# EAGLE design 07D-003 (EAGLE 6.3)
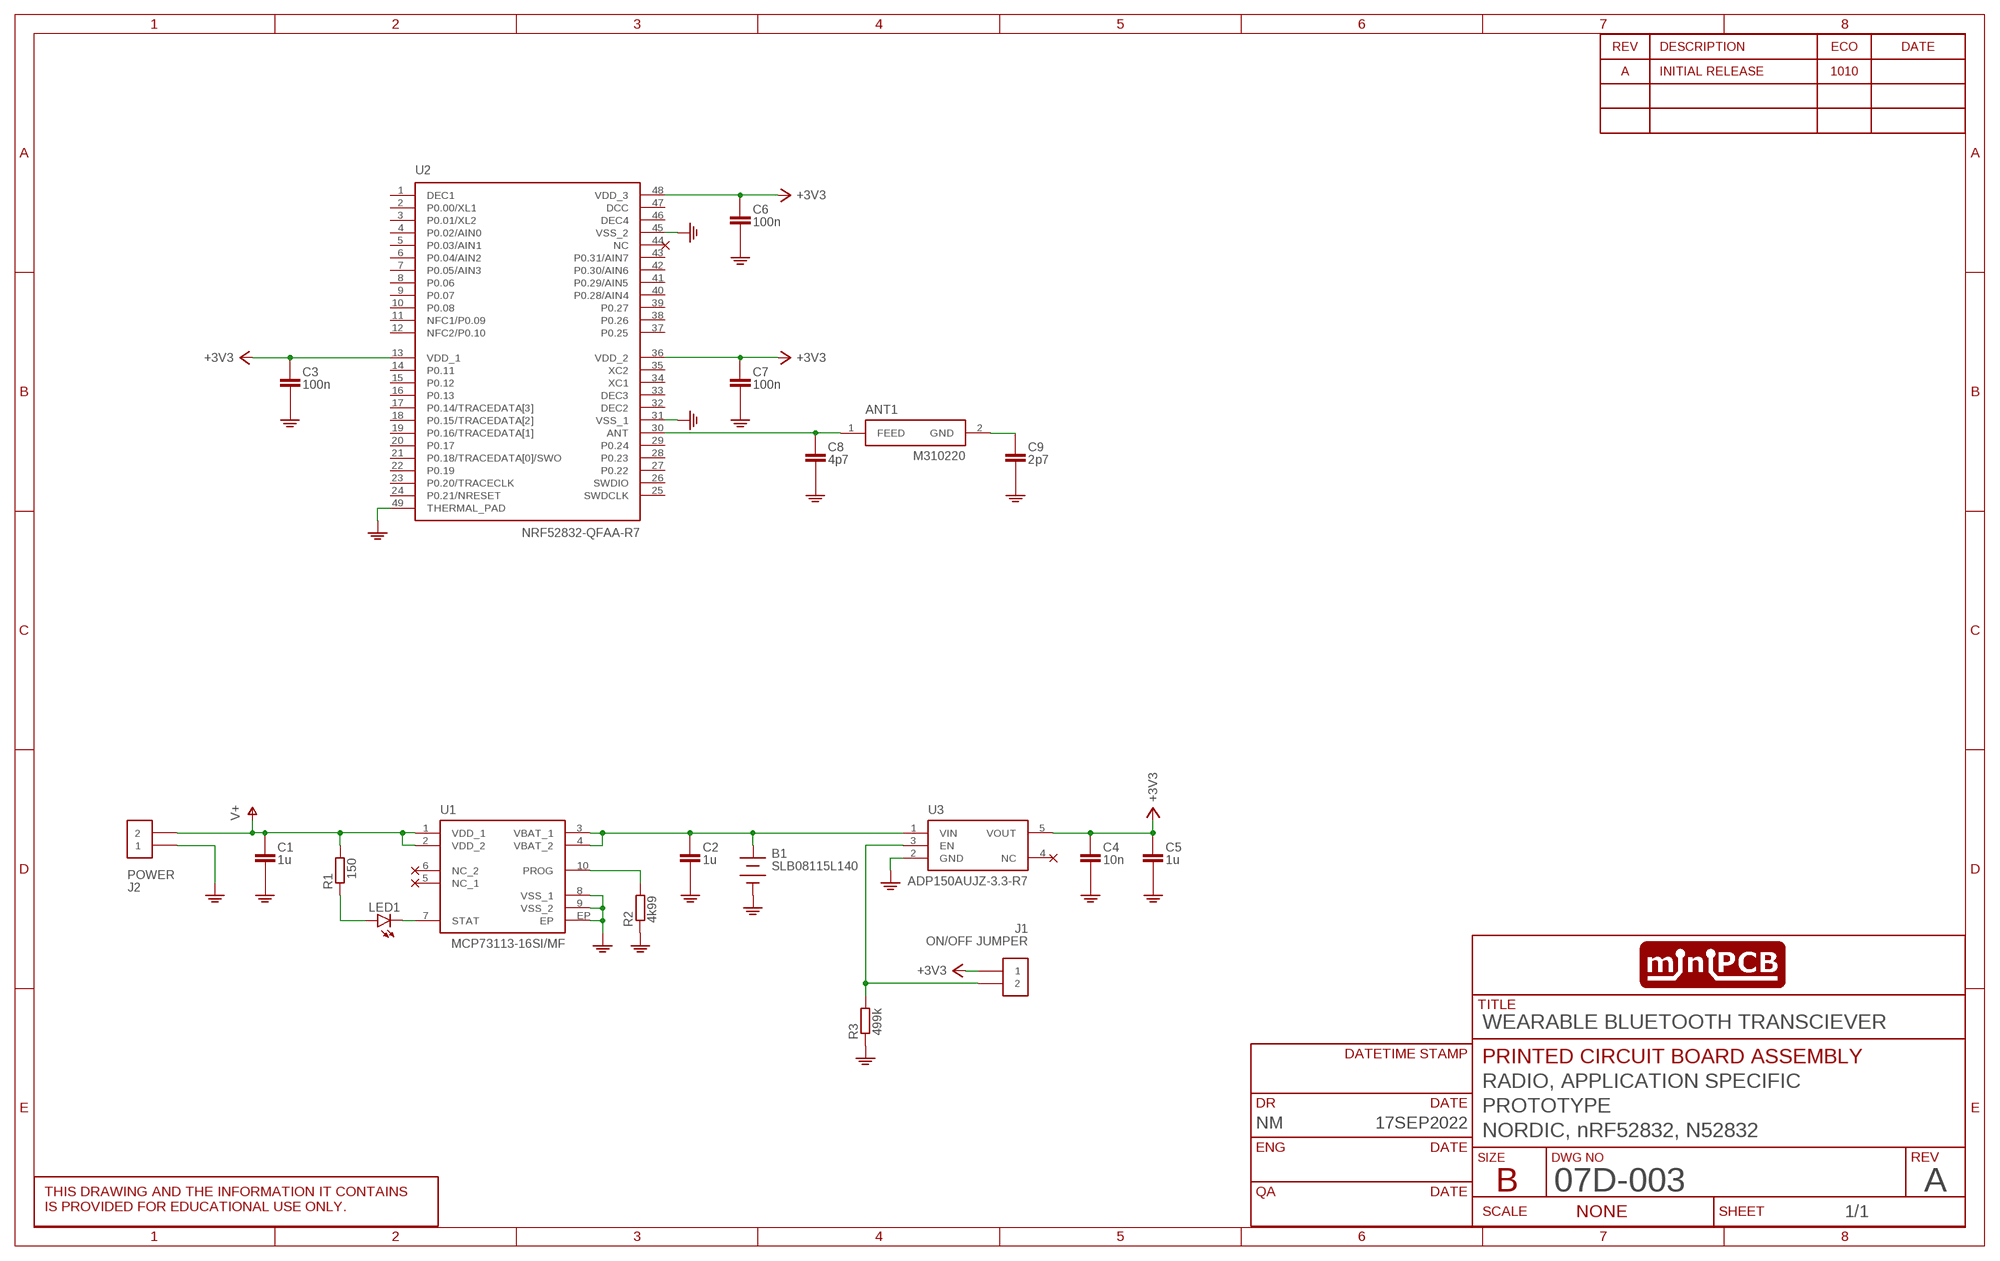
[diagram p0: schematic, sheet 1]
SHEET1 (SCHEMATIC): CIRCUIT_CATEGORY: RADIO, APPLICATION SPECIFIC; CIRCUIT_NAME: PROTOTYPE; CIRCUIT_VARIANT: NORDIC, nRF52832, N52832; DR: NM; DR_DATE: 17SEP2022; PCB_PCBA: PRINTED CIRCUIT BOARD ASSEMBLY; REVA: A; REVA_ECO: 1010; REVISION: A; TITLE: WEARABLE BLUETOOTH TRANSCIEVER

## Parts
ANT1  M310220  [M310220]
B1  SLB08115L140  BATTERYSLB08115L140  [BATTERY_SLB08115L140]
C1  1u  CAPACITOR0402  [C0402]
C2  1u  CAPACITOR0402  [C0402]
C3  100n  CAPACITOR0402  [C0402]
C4  10n  CAPACITOR0402  [C0402]
C5  1u  CAPACITOR0402  [C0402]
C6  100n  CAPACITOR0402  [C0402]
C7  100n  CAPACITOR0402  [C0402]
C8  4p7  CAPACITOR0402  [C0402]
C9  2p7  CAPACITOR0402  [C0402]
J1  ON/OFF JUMPER  PINS_2  [PINS_2]
J2  POWER  PINS_2  [PINS_2]
LED1  LEDSML0603  [SML0603]
R1  150  RESISTOR0402  [R0402]
R2  4k99  RESISTOR0402  [R0402]
R3  499k  RESISTOR0402  [R0402]
U1  MCP73113-16SI/MF  MCP73113-16SI_MF  [DFN-10]
U2  NRF52832-QFAA-R7  [QFN40P600X600X90-49N]
U3  ADP150AUJZ-3.3-R7  ADP150  [SOT25]

## Nets
+3V3: C3.1(+) C4.1(+) C5.1(+) C6.1(+) C7.1(+) J1.1 U2.13(VDD_1) U2.36(VDD_2) U2.48(VDD_3) U3.5(VOUT)
ANTFEED: ANT1.1(FEED) C8.1(+) U2.30(ANT)
ANTGND: ANT1.2(GND) C9.1(+)
B+: B1.1+(+) C2.1(+) U1.3(VBAT_1) U1.4(VBAT_2) U3.1(VIN)
ENABLE: J1.2 R3.2 U3.3(EN)
GND: B1.2-(-) C1.2(-) C2.2(-) C3.2(-) C4.2(-) C5.2(-) C6.2(-) C7.2(-) C8.2(-) C9.2(-) J2.1 R2.1 R3.1 U1.8(VSS_1) U1.9(VSS_2) U1.EP U2.31(VSS_1) U2.45(VSS_2) U2.49(THERMAL_PAD) U3.2(GND)
LED+: LED1.A R1.1
PROG: R2.2 U1.10(PROG)
STAT: LED1.C U1.7(STAT)
V+: C1.1(+) J2.2 R1.2 U1.1(VDD_1) U1.2(VDD_2)
Unconnected: U1.5(NC_1) U1.6(NC_2) U2.1(DEC1) U2.2(P0.00/XL1) U2.3(P0.01/XL2) U2.4(P0.02/AIN0) U2.5(P0.03/AIN1) U2.6(P0.04/AIN2) U2.7(P0.05/AIN3) U2.8(P0.06) U2.9(P0.07) U2.10(P0.08) U2.11(NFC1/P0.09) U2.12(NFC2/P0.10) U2.14(P0.11) U2.15(P0.12) U2.16(P0.13) U2.17(P0.14/TRACEDATA[3]) U2.18(P0.15/TRACEDATA[2]) U2.19(P0.16/TRACEDATA[1]) U2.20(P0.17) U2.21(P0.18/TRACEDATA[0]/SWO) U2.22(P0.19) U2.23(P0.20/TRACECLK) U2.24(P0.21/NRESET) U2.25(SWDCLK) U2.26(SWDIO) U2.27(P0.22) U2.28(P0.23) U2.29(P0.24) U2.32(DEC2) U2.33(DEC3) U2.34(XC1) U2.35(XC2) U2.37(P0.25) U2.38(P0.26) U2.39(P0.27) U2.40(P0.28/AIN4) U2.41(P0.29/AIN5) U2.42(P0.30/AIN6) U2.43(P0.31/AIN7) U2.44(NC) U2.46(DEC4) U2.47(DCC) U3.4(NC)

## Library data of the parts
ANT1 = minipcb:M310220: Antennas Ceramic Chip ANTENNA BT/WLAN 2.4-2.5GHz Source: Datasheet; DESCRIPTION: Antennas Ceramic Chip ANTENNA BT/WLAN 2.4-2.5GHz; HEIGHT: 1.18mm; MANUFACTURER_NAME: Ethertronics / AVX; MANUFACTURER_PART_NUMBER: M310220; MOUSER_PART_NUMBER: 581-M310220; MOUSER_PRICE-STOCK: https://www.mouser.co.uk/ProductDetail/Ethertronics-AVX/M310220?qs=MLItCLRbWsySMY3y23wkRg%3D%3D
B1 = minipcb:BATTERY: 2xAAA battery holder for VIVA
C1-C9 = minipcb:CAPACITOR
J1 J2 = minipcb:PINS_2
LED1 = minipcb:LED: LED OSRAM: - CHIPLED LG R971, LG N971, LY N971, LG Q971, LY Q971, LO R971, LY R971 LH N974, LH R974 LS Q976, LO Q976, LY Q976 LO Q996 - Hyper CHIPLED LW Q18S LB Q993, LB Q99A, LB R99A - SideLED LS A670, LO A670, LY A670, LG A670, LP A670 LB A673, LV A673, LT A673, LW A673 LH A674 LY A675 LS A676, LA A676, LO A676, LY A676, LW A676 LS A679, LY A679, LG A679 - Hyper Micro SIDELED® LS Y876, LA Y876, LO Y876, LY Y876 LT Y87S - SmartLED LW L88C, LW L88S LB L89C, LB L89S, LG L890 LS L89K, LO L89K, LY L89K LS L896, LA L896, LO L896, LY L896 - TOPLED LS T670, LO T670, LY T670, LG T670, LP T670 LSG T670, LSP T670, LSY T670, LOP T670, LYG T670 LG T671, LOG T671, LSG T671 LB T673, LV T673, LT T673, LW T673 LH T674 LS T676, LA T676, LO T676, LY T676, LB T676, LH T676, LSB T676, LW T676 LB T67C, LV T67C, LT T67C, LS T67K, LO T67K, LY T67K, LW E67C LS E67B, LA E67B, LO E67B, LY E67B, LB E67C, LV E67C, LT E67C LW T67C LS T679, LY T679, LG T679 LS T770, LO T770, LY T770, LG T770, LP T770 LB T773, LV T773, LT T773, LW T773 LH T774 LS E675, LA E675, LY E675, LS T675 LS T776, LA T776, LO T776, LY T776, LB T776 LHGB T686 LT T68C, LB T68C - Hyper Mini TOPLED® LB M676 - Mini TOPLED Santana® LG M470 LS M47K, LO M47K, LY M47K Source: http://www.osram.convergy.de LUXEON: - LUMILED® LXK2-PW12-R00, LXK2-PW12-S00, LXK2-PW14-U00, LXK2-PW14-V00 LXK2-PM12-R00, LXK2-PM12-S00, LXK2-PM14-U00 LXK2-PE12-Q00, LXK2-PE12-R00, LXK2-PE12-S00, LXK2-PE14-T00, LXK2-PE14-U00 LXK2-PB12-K00, LXK2-PB12-L00, LXK2-PB12-M00, LXK2-PB14-N00, LXK2-PB14-P00, LXK2-PB14-Q00 LXK2-PR12-L00, LXK2-PR12-M00, LXK2-PR14-Q00, LXK2-PR14-R00 LXK2-PD12-Q00, LXK2-PD12-R00, LXK2-PD12-S00 LXK2-PH12-R00, LXK2-PH12-S00 LXK2-PL12-P00, LXK2-PL12-Q00, LXK2-PL12-R00 Source: www.luxeon.com KINGBRIGHT: KA-3528ASYC Source: www.kingbright.com
R1-R3 = minipcb:RESISTOR
U1 = minipcb:MCP73113-16SI_MF: Single cell 6.5 OVP battery Charger Source: Datasheet <http://ww1.microchip.com/downloads/en/DeviceDoc/20002183E.pdf>
U2 = minipcb:NRF52832-QFAA-R7: RF System on a Chip - SoC Multiprotocol Bluetooth Smart/ANT/2.4GHz SoC Source: Datasheet <http://infocenter.nordicsemi.com/pdf/nRF52832_PS_v1.3.pdf>; DESCRIPTION: RF System on a Chip - SoC Multiprotocol Bluetooth Smart/ANT/2.4GHz SoC; HEIGHT: 0.9mm; MANUFACTURER_NAME: Nordic Semiconductor; MANUFACTURER_PART_NUMBER: nRF52832-QFAA-R7; MOUSER_PART_NUMBER: 949-NRF52832-QFAA-R7; MOUSER_PRICE-STOCK: https://www.mouser.co.uk/ProductDetail/Nordic-Semiconductor/NRF52832-QFAA-R7?qs=4OAmtnimR16jAzs3W9owrg%3D%3D
U3 = minipcb:ADP150: Ultralow Noise, 150mA CMOS Linear Regulator

## Board
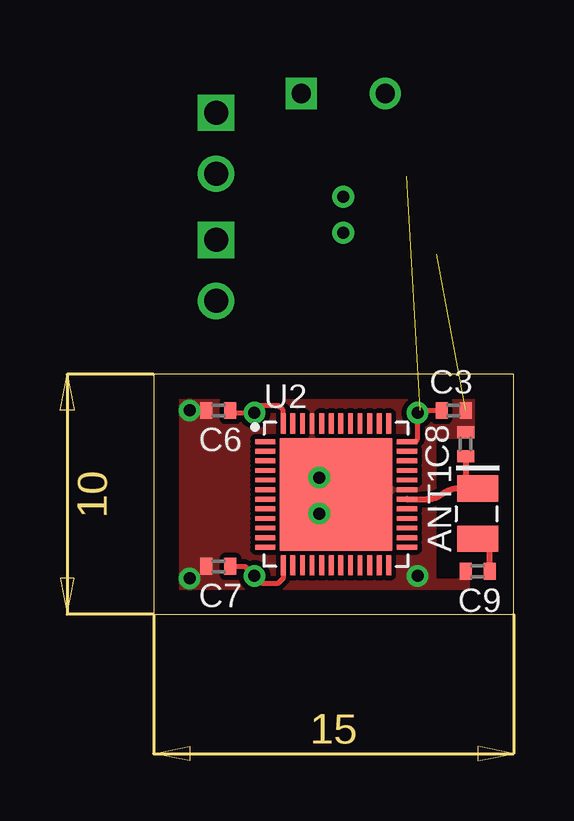
[diagram p1: board, top side]
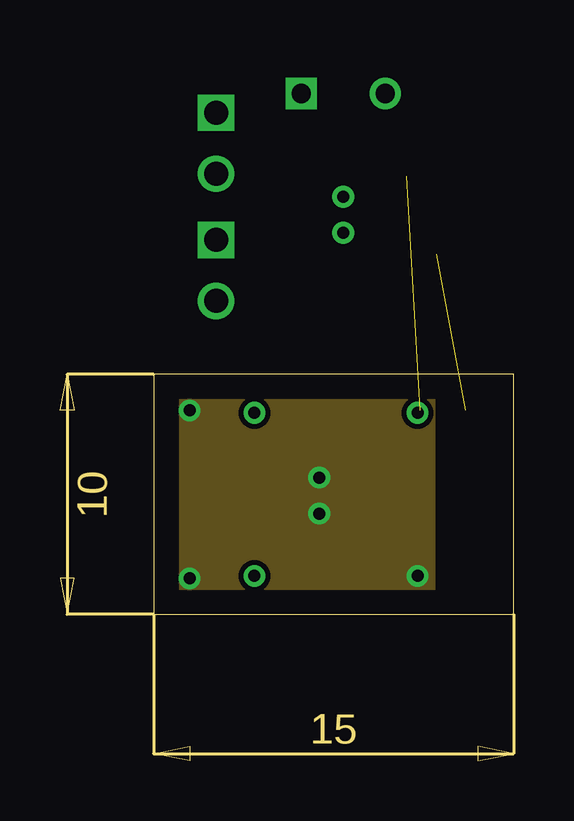
[diagram p2: board, inner layer Signal_L2]
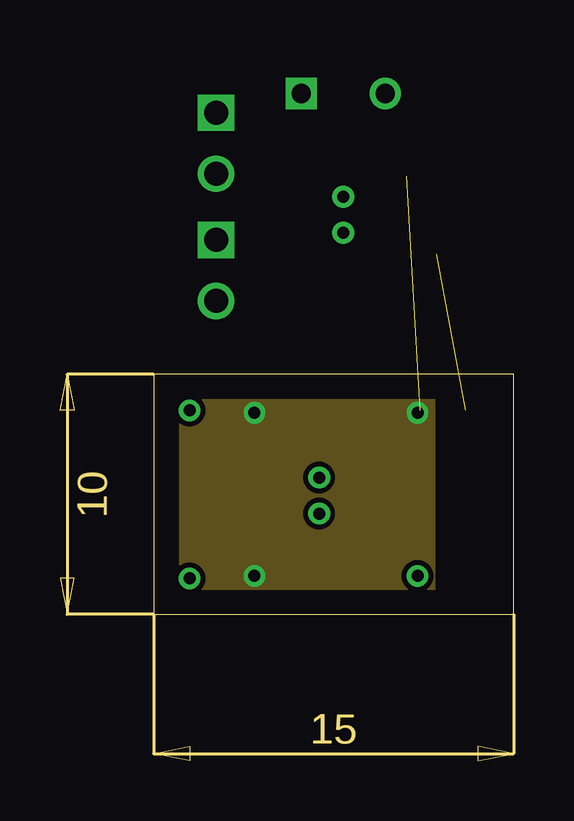
[diagram p3: board, inner layer Power_L3]
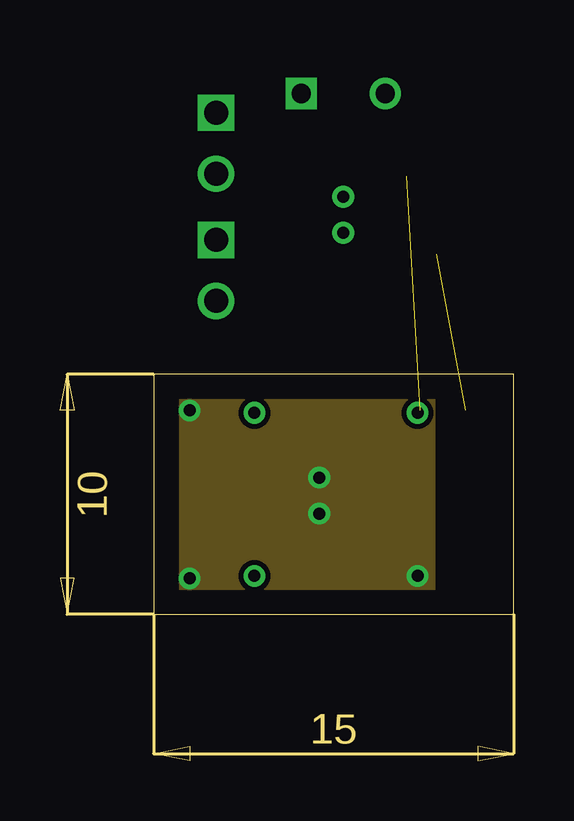
[diagram p4: board, inner layer Ground_L4]
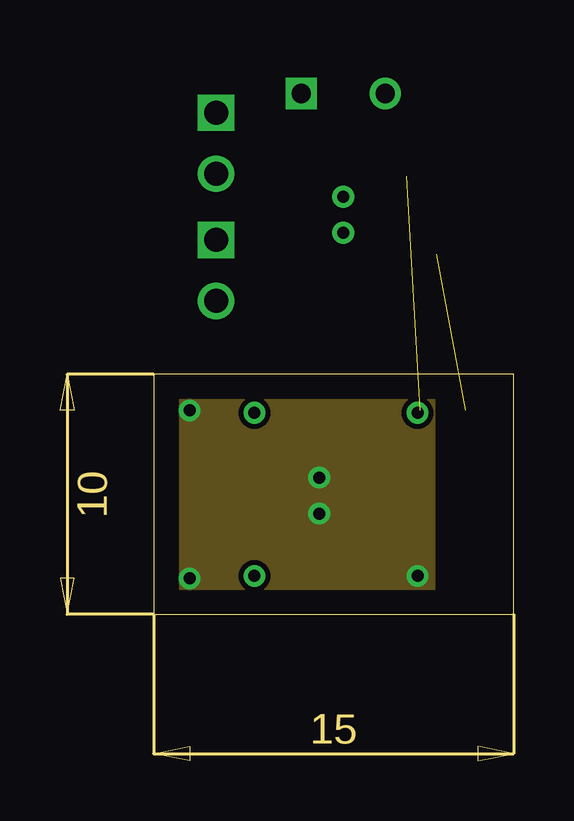
[diagram p5: board, inner layer Signal_L5]
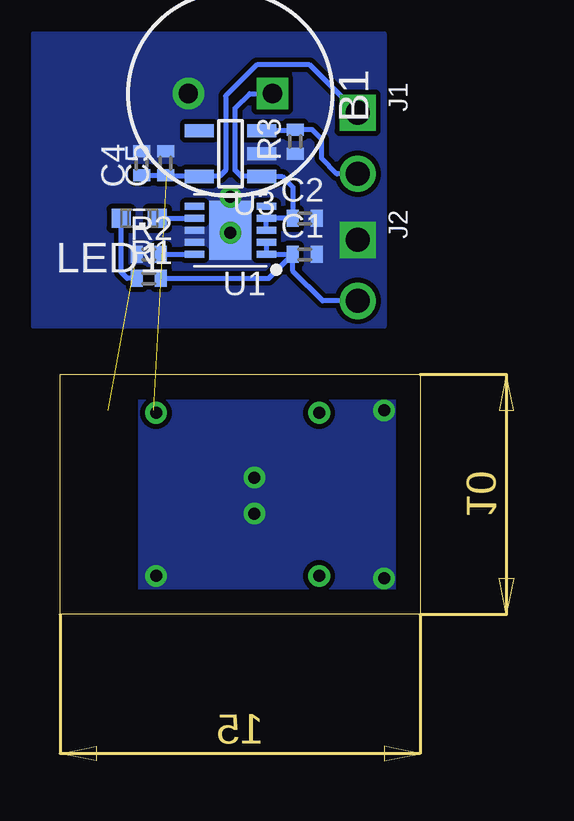
[diagram p6: board, bottom side, seen from below]

Size 18.9 x 16.1 mm. Coordinates in mm from the lower left corner, seen from the top.
Outline: 3.9,6.1 18.9,6.1 18.9,16.1 3.9,16.1 3.9,6.1
Copper layers (1*2*3*4*5*16): Top 0.0125mm / dielectric 0.051mm / Signal_L2 0.0125mm / dielectric 0.051mm / Power_L3 0.0125mm / dielectric 0.051mm / Ground_L4 0.0125mm / dielectric 0.051mm / Signal_L5 0.0125mm / dielectric 0.051mm / Bottom 0.0125mm
Design rules "default *": minimum track width 10mil, minimum drill 24mil, track to track 8mil, track to pad 8mil, pad to pad 8mil, via to via 8mil, smd to smd 8mil, copper to edge 40mil, drill to drill 8mil, minimum pad ring 10mil, minimum via ring 8mil, stop-mask expansion 4mil, vias tented up to drill 20mil, thermal gap 10mil
tRestrict: area 15.7,8.1 to 18.2,13.4; area 15.7,7.6 to 18.2,8.1; area 17.1,7.1 to 18.2,7.6; area 17.3,13.4 to 18.2,15.2

### Footprints (pad centres in the part's own frame; a part is rotated, then mirrored left to right if it is on the bottom)
M310220 = smd 1.1 x 1.7: 1 -1.05,0; 2 1.05,0
BATTERY_SLB08115L140 = drill 0.8 square: 1+ -1.75,0 | drill 0.8: 2- 1.75,0
C0402 = smd 0.5 x 0.7: 1 -0.5,0; 2 0.5,0
PINS_2 = drill 1 square: 1 0,0 | drill 1: 2 2.54,0
SML0603 = smd 0.8 x 0.8: A 0.75,0; C -0.75,0
R0402 = smd 0.5 x 0.7: 1 -0.5,0; 2 0.5,0
DFN-10 = smd 0.8 x 0.3: 1 -1.5,1; 2 -1.5,0.5; 3 -1.5,0; 4 -1.5,-0.5; 5 -1.5,-1; 6 1.5,-1; 7 1.5,-0.5; 8 1.5,0; 9 1.5,0.5; 10 1.5,1 | smd 1.75 x 2.45: EP 0,0
QFN40P600X600X90-49N = smd 0.85 x 0.2: 1 -2.95,2.2; 2 -2.95,1.8; 3 -2.95,1.4; 4 -2.95,1; 5 -2.95,0.6; 6 -2.95,0.2; 7 -2.95,-0.2; 8 -2.95,-0.6; 9 -2.95,-1; 10 -2.95,-1.4; 11 -2.95,-1.8; 12 -2.95,-2.2; 25 2.95,-2.2; 26 2.95,-1.8; 27 2.95,-1.4; 28 2.95,-1; 29 2.95,-0.6; 30 2.95,-0.2; 31 2.95,0.2; 32 2.95,0.6; 33 2.95,1; 34 2.95,1.4; 35 2.95,1.8; 36 2.95,2.2 | smd 0.2 x 0.85: 13 -2.2,-2.95; 14 -1.8,-2.95; 15 -1.4,-2.95; 16 -1,-2.95; 17 -0.6,-2.95; 18 -0.2,-2.95; 19 0.2,-2.95; 20 0.6,-2.95; 21 1,-2.95; 22 1.4,-2.95; 23 1.8,-2.95; 24 2.2,-2.95; 37 2.2,2.95; 38 1.8,2.95; 39 1.4,2.95; 40 1,2.95; 41 0.6,2.95; 42 0.2,2.95; 43 -0.2,2.95; 44 -0.6,2.95; 45 -1,2.95; 46 -1.4,2.95; 47 -1.8,2.95; 48 -2.2,2.95 | smd 4.7 x 4.7: 49 0,0
SOT25 = smd 0.55 x 1.2: 1 -0.95,-1.3; 2 0,-1.3; 3 0.95,-1.3; 4 0.95,1.3; 5 -0.95,1.3

### Placement (x,y rotation side)
ANT1  17.4,10.3 270 top
B1  11.8,27.8 180 bottom  (outside the outline)
C1  8.7,21.1 0 bottom  (outside the outline)
C2  8.7,22.6 0 bottom  (outside the outline)
C3  16.4,14.6 0 top
C4  15.5,24.9 90 bottom  (outside the outline)
C5  14.5,24.9 90 bottom  (outside the outline)
C6  6.6,14.6 180 top
C7  6.6,8.1 180 top
C8  16.9,13.2 90 top
C9  17.4,7.9 180 top
J1  6.5,27 270 bottom  (outside the outline)
J2  6.5,21.7 270 bottom  (outside the outline)
LED1  15.6,22.6 180 bottom  (outside the outline)
R1  15.2,20.1 0 bottom  (outside the outline)
R2  15.2,21.1 0 bottom  (outside the outline)
R3  9.1,25.8 90 bottom  (outside the outline)
U1  11.8,22.1 180 bottom  (outside the outline)
U2  11.5,11.1 0 top
U3  11.8,25.3 90 bottom  (outside the outline)

### Tracks (layer width: path | path; a pad name or v marks a point on that pad's centre or on a via)
+3V3  (via drill 0.5)  (1 unrouted)
  Top 0.2: U2.13 9.3,7.6 9.1,7.4 8.4,7.4 v8.1,7.7 7.7,8.1 C7.1 | U2.36 14.8,13.3 14.9,13.4 v14.9,14.5 15,14.6 C3.1 | C6.1 7.2,14.5 v8.1,14.5 8.4,14.8 9.1,14.8 9.3,14.6 U2.48
  Bottom 0.2: C4.1 C5.1 14.45,24.35 U3.5 12.25,24.35 12,24.6 12,27.7 10.7,29 8.5,29 J1.1
  pour Power_L3 (no thermals): 4.9,7.1 15.6,7.1 15.6,15.1 4.9,15.1
ANTFEED
  Top 0.254: C8.1 16.9,11.85 ANT1.1 | 17.15,11.6 ANT1.1 | 17.25,11.2 ANT1.1 | U2.30 15.3,10.9 arc37 15.9,11.1 arc-25 16.45,11.35 ANT1.1
ANTGND
  Top 0.254: C9.1 17.9,8.75 ANT1.2
B+
  Bottom 0.2: U1.3 U1.4 C2.1 9.2,23.9 9.65,24.35 U3.1 11.35,24.35 11.6,24.6 11.6,27.2 11,27.8 B1.1+
ENABLE
  Bottom 0.2: J1.2 7.36,24.46 8,25.1 8,25.9 8.4,26.3 R3.2 9.15,26.25 U3.3
GND  (via drill 0.5)  (1 unrouted)
  other vias: 14.9,7.7 10.8,10.3 10.8,11.8 5.4,7.6 5.4,14.6 11.8,22 11.8,23.5
  pour Top (no thermals): 4.9,7.1 18.4,7.1 18.4,15.1 4.9,15.1
  pour Bottom (no thermals): 4.9,7.1 15.6,7.1 15.6,15.1 4.9,15.1
  pour Signal_L2 (no thermals): 4.9,7.1 15.6,7.1 15.6,15.1 4.9,15.1
  pour Ground_L4 (no thermals): 4.9,7.1 15.6,7.1 15.6,15.1 4.9,15.1
  pour Signal_L5 (no thermals): 4.9,7.1 15.6,7.1 15.6,15.1 4.9,15.1
  pour Bottom (no thermals): 5.4,18.1 20,18.1 20,30.3 5.4,30.3
LED+
  Bottom 0.2: R1.1 16.1,20.1 16.35,20.35 LED1.A
PROG
  Bottom 0.2: R2.2 U1.10
STAT
  Bottom 0.2: LED1.C U1.7
V+
  Bottom 0.2: C1.1 U1.1 U1.2 | R1.2 10.2,20.1 C1.1 | J2.2 7.96,19.16 9.2,20.4 C1.1